# Altium schematic sheet ID_logic.SchDoc
size A4
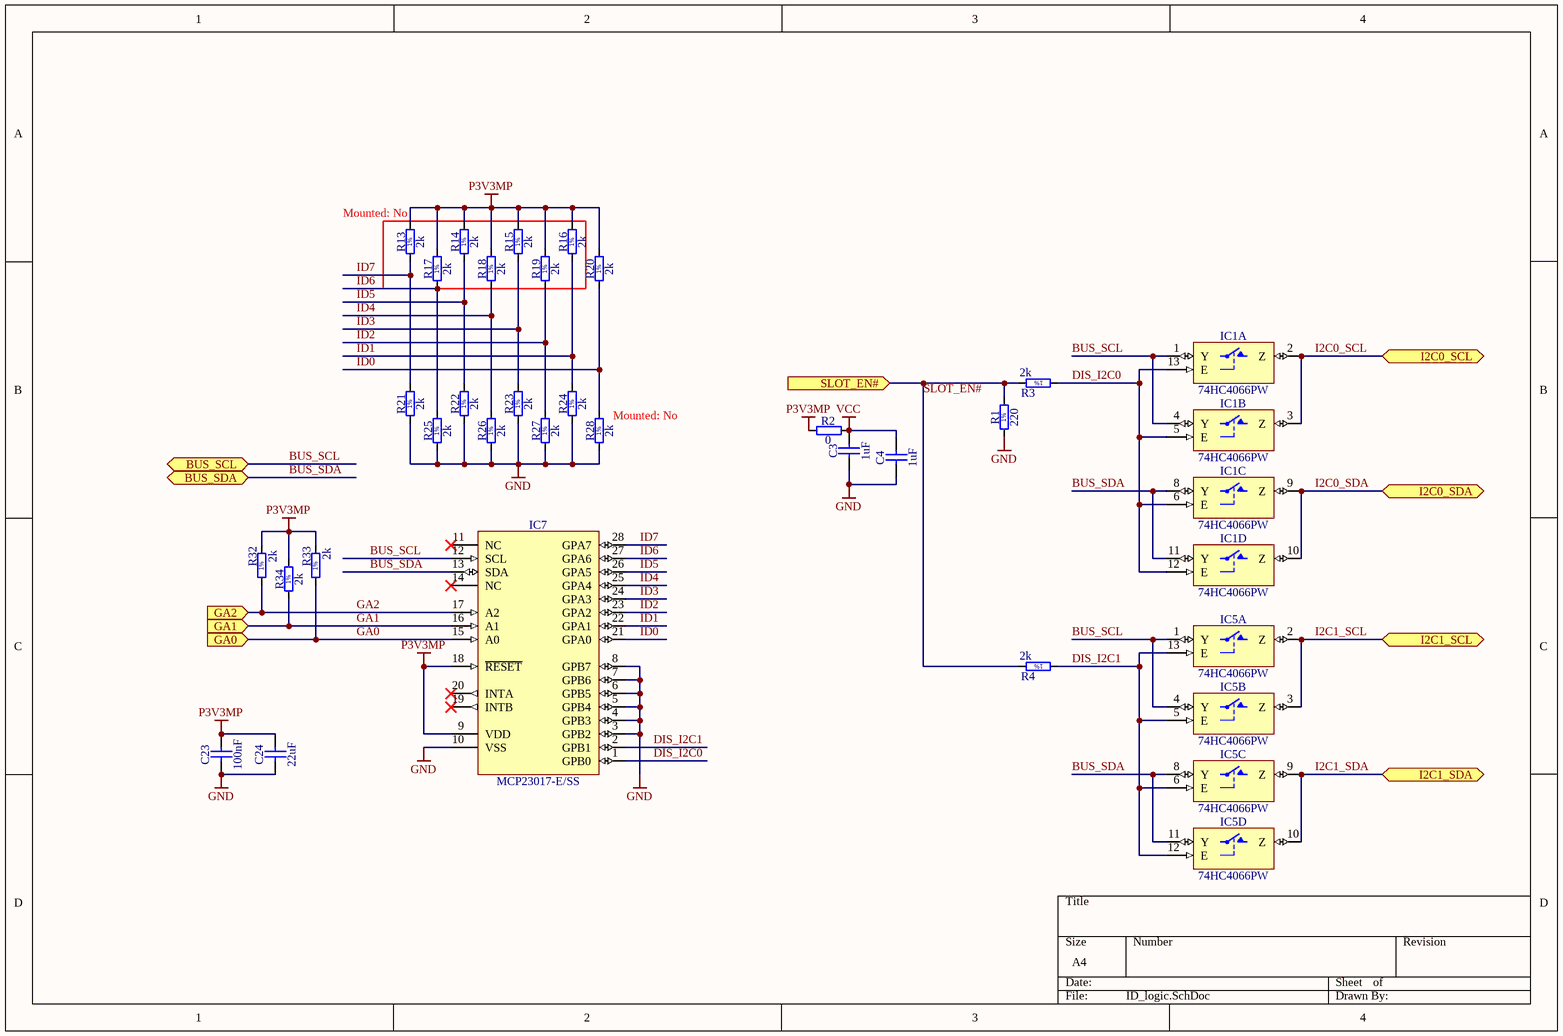
[diagram p0: ID_logic.SchDoc]

## Parts
C3  1uF  [CAPC2012X140N]
C4  1uF  [CAPC2012X140N]
C23  100nF  [CAPC3216X140N]
C24  22uF  [CAPC3216X180N]
IC1  74HC4066PW  [SOP65P640X110-14N]  (parts A,B,C,D of 4)
IC5  74HC4066PW  [SOP65P640X110-14N]  (parts A,B,C,D of 4)
IC7  MCP23017-E/SS  [SOP65P780X200-28N]
R1  220  [RESC1608X55N]
R2  0  [RESC1005X40N]
R3  2k  [RESC1608X55N]
R4  2k  [RESC1608X55N]
R13  2k  Mounted: No  [RESC1608X55N]
R14  2k  [RESC1608X55N]
R15  2k  [RESC1608X55N]
R16  2k  [RESC1608X55N]
R17  2k  [RESC1608X55N]
R18  2k  [RESC1608X55N]
R19  2k  [RESC1608X55N]
R20  2k  [RESC1608X55N]
R21  2k  [RESC1608X55N]
R22  2k  [RESC1608X55N]
R23  2k  [RESC1608X55N]
R24  2k  [RESC1608X55N]
R25  2k  [RESC1608X55N]
R26  2k  [RESC1608X55N]
R27  2k  [RESC1608X55N]
R28  2k  Mounted: No  [RESC1608X55N]
R32  2k  [RESC1608X55N]
R33  2k  [RESC1608X55N]
R34  2k  [RESC1608X55N]

## Ports
BUS_SCL (bidir), BUS_SDA (bidir), GA0 (in), GA1 (in), GA2 (in), I2C0_SCL (bidir), I2C0_SDA (bidir), I2C1_SCL (bidir), I2C1_SDA (bidir), SLOT_EN# (in)

## Nets
GND: C3.1 C4.1 C23.1 C24.1 IC1.7(GND) IC5.7(GND) IC7.3(GPB2) IC7.4(GPB3) IC7.5(GPB4) IC7.6(GPB5) IC7.7(GPB6) IC7.8(GPB7) IC7.10(VSS) R1.1 R21.1 R22.1 R23.1 R24.1 R25.1 R26.1 R27.1 R28.1
P3V3MP: C23.2 C24.2 IC7.9(VDD) IC7.18(~{RESET}) R2.1 R13.2 R14.2 R15.2 R16.2 R17.2 R18.2 R19.2 R20.2 R32.2 R33.2 R34.2
VCC: C3.2 C4.2 IC1.14(VCC) IC5.14(VCC) R2.2
BUS_SCL: IC1.1(Y) IC1.4(Y) IC5.1(Y) IC5.4(Y) IC7.12(SCL) ; port BUS_SCL
BUS_SDA: IC1.8(Y) IC1.11(Y) IC5.8(Y) IC5.11(Y) IC7.13(SDA) ; port BUS_SDA
DIS_I2C0: IC1.5(E) IC1.6(E) IC1.12(E) IC1.13(E) IC7.1(GPB0) R3.1
DIS_I2C1: IC5.5(E) IC5.6(E) IC5.12(E) IC5.13(E) IC7.2(GPB1) R4.1
GA0: IC7.15(A0) R33.1 ; port GA0
GA1: IC7.16(A1) R34.1 ; port GA1
GA2: IC7.17(A2) R32.1 ; port GA2
I2C0_SCL: IC1.2(Z) IC1.3(Z) ; port I2C0_SCL
I2C0_SDA: IC1.9(Z) IC1.10(Z) ; port I2C0_SDA
I2C1_SCL: IC5.2(Z) IC5.3(Z) ; port I2C1_SCL
I2C1_SDA: IC5.9(Z) IC5.10(Z) ; port I2C1_SDA
ID0: IC7.21(GPA0) R20.1 R28.2
ID1: IC7.22(GPA1) R16.1 R24.2
ID2: IC7.23(GPA2) R19.1 R27.2
ID3: IC7.24(GPA3) R15.1 R23.2
ID4: IC7.25(GPA4) R18.1 R26.2
ID5: IC7.26(GPA5) R14.1 R22.2
ID6: IC7.27(GPA6) R17.1 R25.2
ID7: IC7.28(GPA7) R13.1 R21.2
SLOT_EN#: R1.2 R3.2 R4.2 ; port SLOT_EN#

Not connected (* = marked no-connect by the designer): IC7 11(NC)* 14(NC)* 19(INTB)* 20(INTA)*

## Notes on the sheet
- (in symbol R0603_2K_1%_0.1W_100PPM) 1%
- (in symbol R0603_220R_1%_0.1W_100PPM) 1%

## Library data of the parts
C3 C4 = CC0805_1UF_35V_20%_X7R: Non-polarised capacitor; Part Description: SMD Multilayer Chip Ceramic Capacitor; Manufacturer: GENERIC; Manufacturer1 Part Number: GMK212B7105MG-T; Voltage: 35V; TC: X7R; Tolerance: ±20%; Part Number: CC0805_1UF_35V_20%_X7R; Component Kind: Standard; Component Type: Standard; Pin Count: 2; Value: 1uF; Status: Not Recommended; Manufacturer Part Number: CC0805_1UF_35V_20%_X7R; Case: 0805; Mounted: Yes; Socket: No; SMD: Yes; Sense: No; Manufacturer1 Example: TAIYO YUDEN; Manufacturer1 ComponentHeight: 1.35mm; HelpURL: \\cern.ch\dfs\Applications\Altium\Datasheets\CC0805_X7R_TAIYO-YUDEN_HIGH-VALUE.pdf; Author: CERN DEM JLC; CreateDate: 22.06.2011; LatestRevisionDate: 22.06.2011
C23 = CC1206_100NF_50V_10%_X7R: Non-polarised capacitor; Part Description: SMD Multilayer Chip Ceramic Capacitor; Manufacturer: GENERIC; Manufacturer1 Part Number: VJ1206Y104KXAAT; Voltage: 50V; TC: X7R; Tolerance: ±10%; Part Number: CC1206_100NF_50V_10%_X7R; Component Kind: Standard; Component Type: Standard; Pin Count: 2; Value: 100nF; Status: Preferred; Manufacturer Part Number: CC1206_100NF_50V_10%_X7R; Case: 1206; Mounted: Yes; Socket: No; SMD: Yes; Sense: No; Manufacturer1 Example: VISHAY VITRAMON; Manufacturer1 ComponentHeight: 1.7mm; HelpURL: \\cern.ch\dfs\Applications\Altium\Datasheets\CC1206_X7R_VISHAY_VJ.pdf; Author: CERN DEM JLC; CreateDate: 03/12/2007; LatestRevisionDate: 03/12/2007
C24 = CC1206_22UF_35V_20%_JB_TDK_C3216JB1V226M160AC: Non-polarised capacitor; Part Description: SMD Multilayer Chip Ceramic Capacitor; Manufacturer: TDK; Voltage: 35V; TC: JB(±10%); Tolerance: ±20%; Part Number: CC1206_22UF_35V_20%_JB_TDK_C3216JB1V226M160AC; Component Kind: Standard; Component Type: Standard; Pin Count: 2; Value: 22uF; Status: None; Manufacturer Part Number: C3216JB1V226M160AC; Case: 1206; Mounted: Yes; Socket: No; SMD: Yes; Sense: No; ComponentHeight: 1.8mm; HelpURL: \\cern.ch\dfs\Applications\Altium\Datasheets\CC1206_TDK_C3216JB1V226M160AC.pdf; Author: CERN DEM JLC; CreateDate: 13/07/2017; LatestRevisionDate: 13/07/2017
IC1 IC5 = 74HC4066PW: Part Description: Quad Single-Pole Single-Throw Analog Switch; Manufacturer: NXP SEMICONDUCTORS; PressFit: No; Bonding: No; Part Number: 74HC4066PW; Component Kind: Standard; Component Type: Standard; Device: 74HC4066PW; PackageDescription: SOP, 14-Leads, Body 4.4x5mm (max), Pitch 0.65mm, IPC Medium Density; Manufacturer Part Number: 74HC4066PW; Pin Count: 14; Case: TSSOP14; Mounted: Yes; Socket: No; SMD: Yes; Sense: No; ComponentHeight: 1.1mm; Author: CERN DEM JLC; HelpURL: \\cern.ch\dfs\Applications\Altium\Datasheets\74HC4066PW.pdf; CreateDate: 19.11.2014; LatestRevisionDate: 19.11.2014
IC7 = MCP23017-E/SS: 16-bit I/O Port Expander With Serial Interface; Manufacturer: MICROCHIP TECHNOLOGY; PressFit: No; Bonding: No; Part Number: MCP23017-E/SS; Component Kind: Standard; Component Type: Standard; Device: MCP23017-E/SS; PackageDescription: SOP, 0.65mm Pitch; 28 pin, 5.30mm W X 10.20mm L X 2.00mm H body, IPC Medium Density; Part Description: 16-bit I/O Port Expander With Serial Interface; Manufacturer Part Number: MCP23017-E/SS; Pin Count: 28; Case: SSOP28; Mounted: Yes; Socket: No; SMD: Yes; Sense: No; ComponentHeight: 2mm; Author: CERN DEM JLC; HelpURL: \\cern.ch\dfs\Applications\Altium\Datasheets\MCP23017-E-SS.pdf; CreateDate: 17/01/2011; LatestRevisionDate: 17/01/2011
R1 = R0603_220R_1%_0.1W_100PPM: Resistor - 1%; Part Description: General Purpose Thick Film Chip Resistor; Manufacturer: GENERIC; Manufacturer1 Part Number: NRC06F2200TRF; Power: 0.1W; TC: ±100ppm/°C; PressFit: No; Part Number: R0603_220R_1%_0.1W_100PPM; Component Kind: Standard; Component Type: Standard; Pin Count: 2; Value: 220; Status: Preferred; Tolerance: ±1%; Manufacturer Part Number: R0603_220R_1%_0.1W_100PPM; Case: 0603; Mounted: Yes; Sense: No; Socket: No; SMD: Yes; Manufacturer1 Example: NIC COMPONENT; Manufacturer1 ComponentHeight: 0.55mm; HelpURL: \\cern.ch\dfs\Applications\Altium\Datasheets\R0603_NIC_NRC.pdf; Author: CERN DEM JLC; CreateDate: 03.12.2007; LatestRevisionDate: 13.03.2008
R2 = R0402_0R_JUMPER: Resistor; Part Description: 1A (0.05R Max DC Resistance) Zero Ohm Jumper; Manufacturer: GENERIC; Manufacturer1 Part Number: 232270591001L; PressFit: No; Part Number: R0402_0R_JUMPER; Component Kind: Standard; Component Type: Standard; Pin Count: 2; Value: 0; Status: Not Recommended; Manufacturer Part Number: R0402_0R_JUMPER; Case: 0402; Mounted: Yes; Sense: No; Socket: No; SMD: Yes; Manufacturer1 Example: YAGEO PHYCOMP; Manufacturer1 ComponentHeight: 0.4mm; HelpURL: \\cern.ch\dfs\Applications\Altium\Datasheets\R0402_Phycomp_RC0402.pdf; Author: CERN DEM JLC; CreateDate: 03.12.2007; LatestRevisionDate: 17.10.2012
R3 R4 R13 R20-R28 R32-R34 = R0603_2K_1%_0.1W_100PPM: Resistor - 1%; Part Description: General Purpose Thick Film Chip Resistor; Manufacturer: GENERIC; Manufacturer1 Part Number: NRC06F2001TRF; Power: 0.1W; TC: ±100ppm/°C; PressFit: No; Part Number: R0603_2K_1%_0.1W_100PPM; Component Kind: Standard; Component Type: Standard; Pin Count: 2; Value: 2k; Status: Preferred; Tolerance: ±1%; Manufacturer Part Number: R0603_2K_1%_0.1W_100PPM; Case: 0603; Sense: No; Socket: No; SMD: Yes; Manufacturer1 Example: NIC COMPONENT; Manufacturer1 ComponentHeight: 0.55mm; HelpURL: \\cern.ch\dfs\Applications\Altium\Datasheets\R0603_NIC_NRC.pdf; Author: CERN DEM JLC; CreateDate: 03/12/2007; LatestRevisionDate: 13/03/2008
  R3 R4 R20-R27 R32-R34: Mounted: Yes
  R13 R28: ClassName: NotMounted
R14-R19 = R0603_2K_1%_0.1W_100PPM: Resistor - 1%; Part Description: General Purpose Thick Film Chip Resistor; Manufacturer: GENERIC; Manufacturer1 Part Number: NRC06F2001TRF; Power: 0.1W; TC: ±100ppm/°C; PressFit: No; Mounted: No; Part Number: R0603_2K_1%_0.1W_100PPM; Component Kind: Standard; Component Type: Standard; Pin Count: 2; Value: 2k; Status: Preferred; Tolerance: ±1%; Manufacturer Part Number: R0603_2K_1%_0.1W_100PPM; Case: 0603; Sense: No; Socket: No; SMD: Yes; Manufacturer1 Example: NIC COMPONENT; Manufacturer1 ComponentHeight: 0.55mm; HelpURL: \\cern.ch\dfs\Applications\Altium\Datasheets\R0603_NIC_NRC.pdf; Author: CERN DEM JLC; CreateDate: 03/12/2007; LatestRevisionDate: 13/03/2008; ClassName: NotMounted